# EAGLE schematic Pixel-1 (EAGLE 8.3.2)
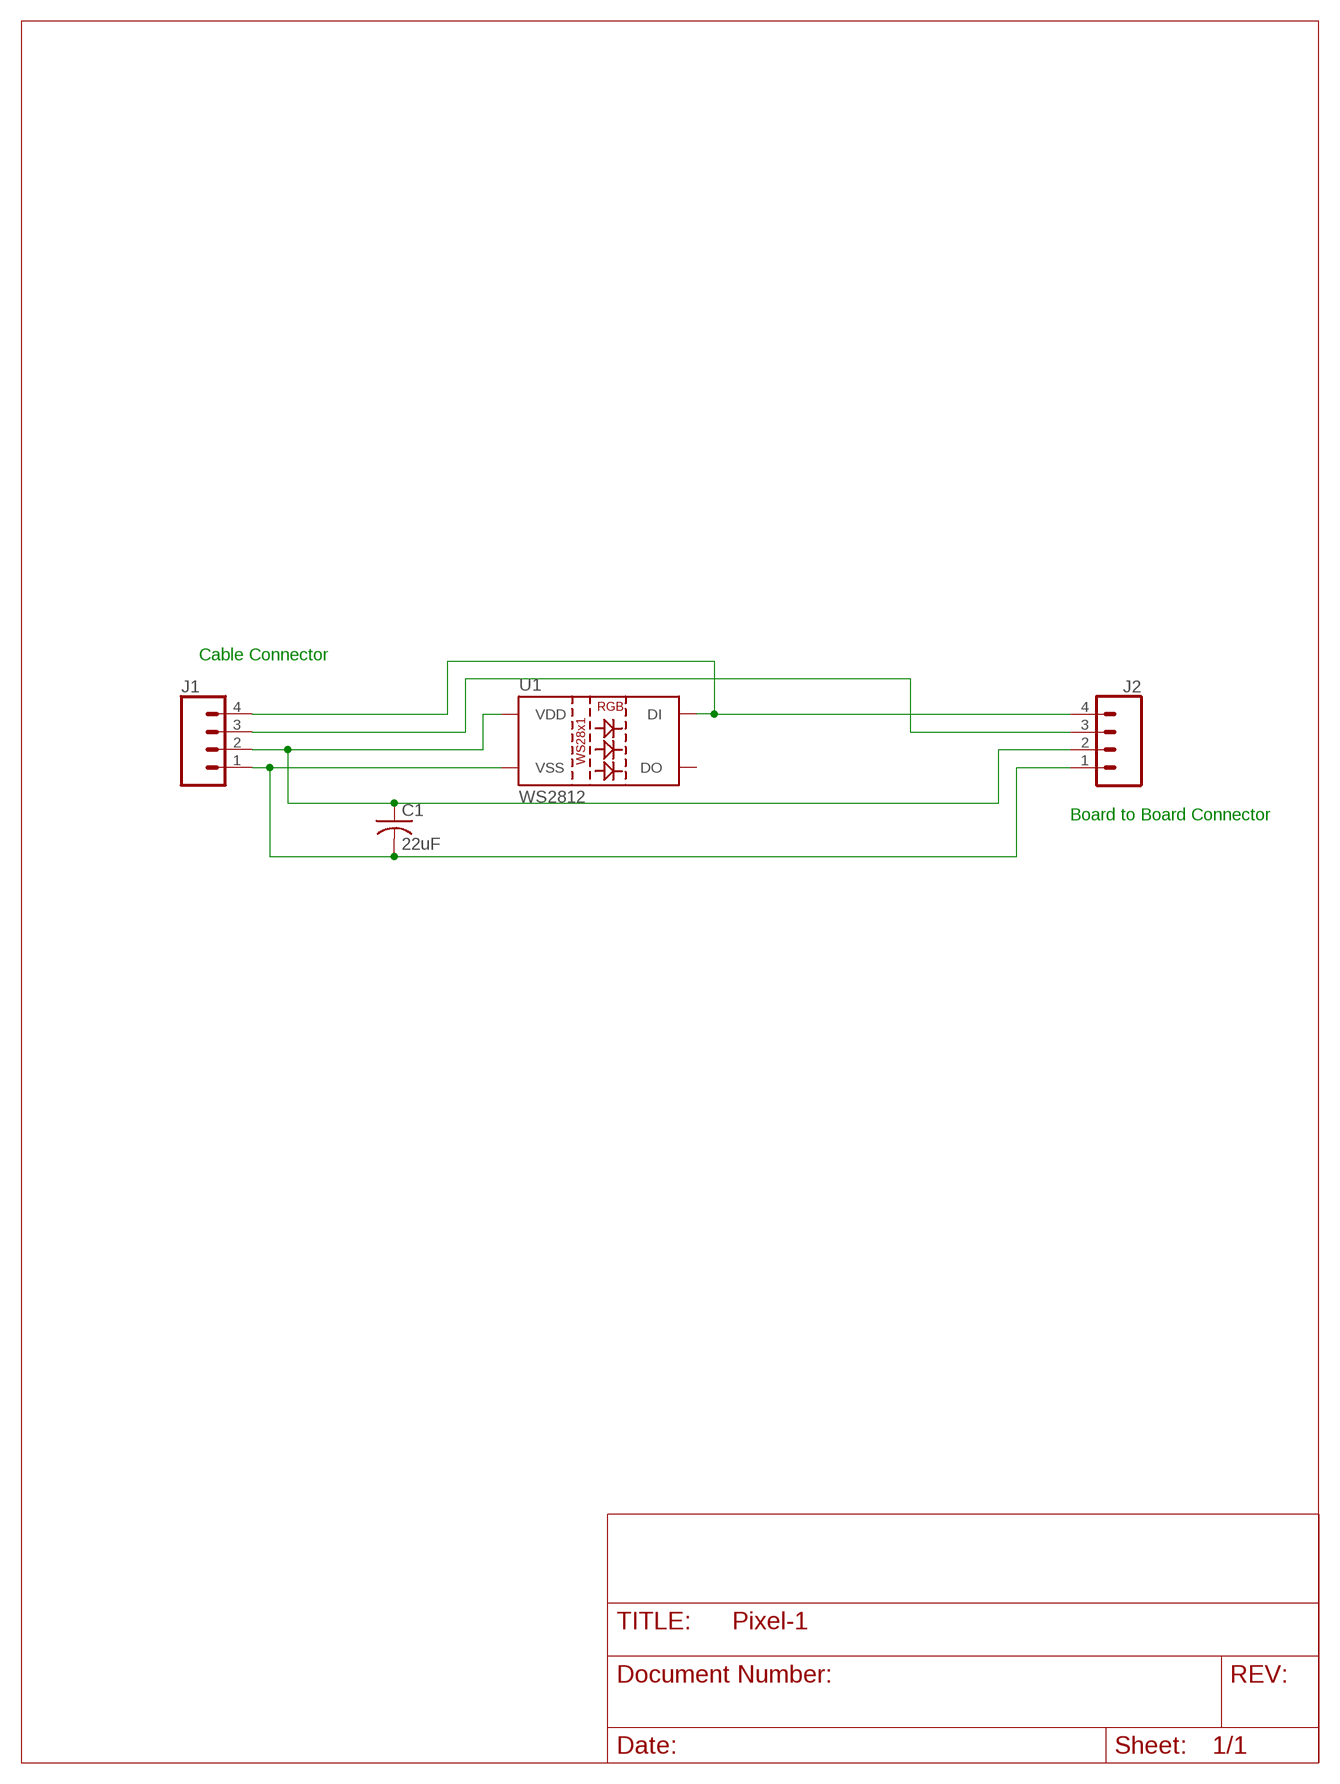
[diagram p0: schematic, sheet 1]

## Parts
C1  22uF  C-USC0402  [C0402]
J1  CONN_04  [1X04]
J2  CONN_04  [1X04]
U1  WS2812  WS2812"  [LED-TRICOLOR-5050-IC]

## Nets
N$1: C1.2 J1.1 J2.1 U1.6(VSS)
N$2: C1.1 J1.2 J2.2 U1.3(VDD) U1.5(VDD)
N$3: J1.3 J2.3
N$4: J1.4 J2.4 U1.2(DI)
Unconnected: U1.1(DO)

## Notes on the sheet
- Cable Connector
- Board to Board Connector

## Library data of the parts
C1 = adafruit:C-US: CAPACITOR, American symbol
J1 J2 = SparkFun-Connectors:CONN_04: Multi connection point. Often used as Generic Header-pin footprint for 0.1 inch spaced/style header connections On any of the 0.1 inch spaced packages, you can populate with these: Break Away Headers - Straight <https://www.sparkfun.com/products/116> (PRT-00116) Break Away Male Headers - Right Angle <https://www.sparkfun.com/products/553> (PRT-00553) Female Headers <https://www.sparkfun.com/products/115> (PRT-00115) Break Away Headers - Machine Pin <https://www.sparkfun.com/products/117> (PRT-00117) Break Away Female Headers - Swiss Machine Pin <https://www.sparkfun.com/products/743> (PRT-00743) For SCREWTERMINALS and SPRING TERMINALS visit here: Screw Terimnals on SparkFun.com <https://www.sparkfun.com/search/results?term=Screw+Terminals> (5mm/3.5mm/2.54mm spacing) This device is also useful as a general connection point to wire up your design to another part of your project. Our various solder wires solder well into these plated through hole pads. Hook-Up Wire - Assortment (Stranded, 22 AWG) <https://www.sparkfun.com/products/11375> (PRT-11375) Hook-Up Wire - Assortment (Solid Core, 22 AWG) <https://www.sparkfun.com/products/11367> (PRT-11367) View the entire wire category on our website here <https://www.sparkfun.com/categories/141> Special notes: Molex polarized connector foot print use with SKU : PRT-08231 with associated crimp pins and housings. 1MM SMD Version SKU: PRT-10208; PROD_ID: CONN-09696
U1 = SparkFun-LED:WS2812: WS2812 RGB LED w/ WS2811 driver 5x5mm SMD LED with built-in controller IC. Color: Red/Green/Blue mC Rating: RGB: 550, 1100, 200 mcd Current:RGB: 20, 20, 20 mA Forward Voltage: RGB: 1.8, 3.0, 3.2 V Packages:LED-TRICOLOR-5050-IC SparkFun Products: LED-SMD RGB (WS2812) <https://www.sparkfun.com/products/11821>; PROD_ID: DIO-11598